# Altium schematic sheet MotorDriver_FileInfo.SchDoc
size A; SheetNumber: 2; SheetTotal: 4
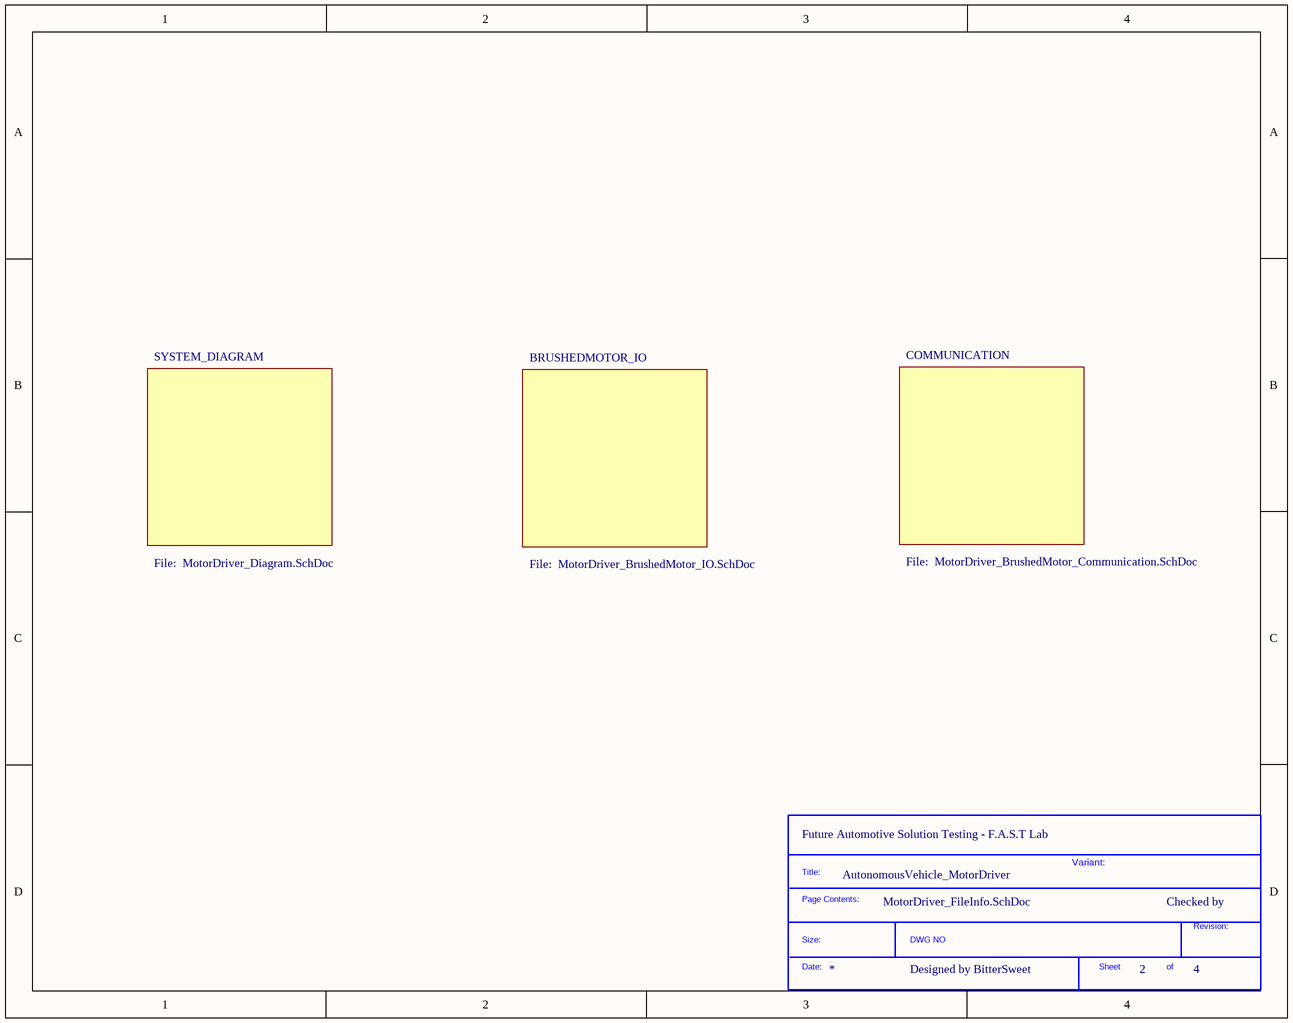
[diagram p0: MotorDriver_FileInfo.SchDoc]

## Parts
*?  SDTitleBlock  (value not drawn)  (graphical)

## Notes on the sheet
- SYSTEM_DIAGRAM
- BRUSHEDMOTOR_IO
- COMMUNICATION
- File:  MotorDriver_Diagram.SchDoc
- File:  MotorDriver_BrushedMotor_IO.SchDoc
- File:  MotorDriver_BrushedMotor_Communication.SchDoc
- (near *?) Future Automotive Solution Testing - F.A.S.T Lab
- AutonomousVehicle_MotorDriver
- Variant:
- Checked by
- Designed by BitterSweet
- (in symbol SDTitleBlock) Title:; Page Contents:; Revision:; Size:; DWG NO; Date:; Sheet; of